# EAGLE design WiFly (EAGLE 9.6.2)
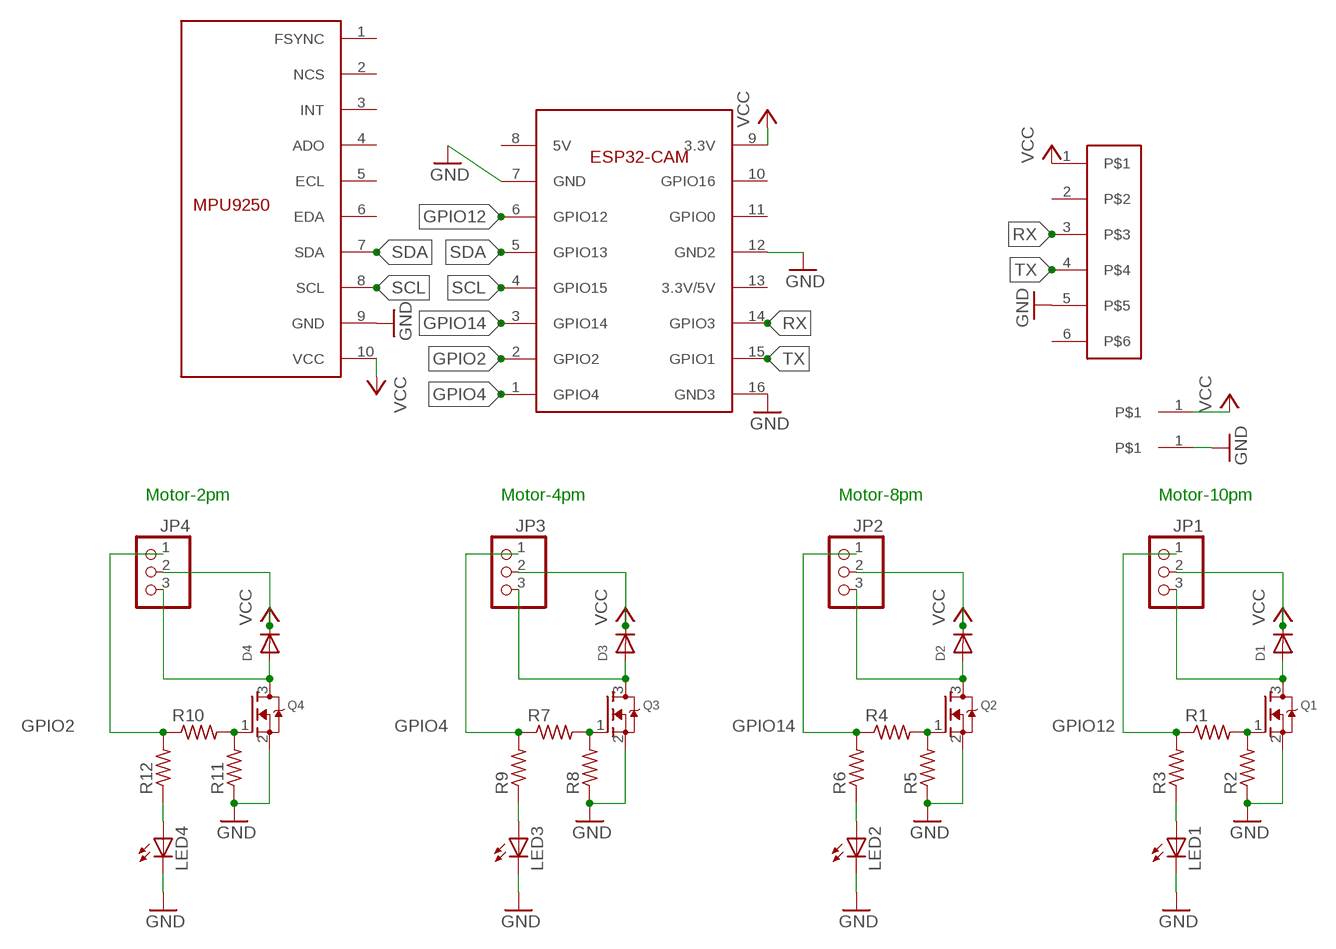
[diagram p0: schematic, sheet 1]

## Parts
+  22AWG22AWG-MALE  [HDRV1W64P0_1X1_193X193X447B]
-  22AWG22AWG-MALE  [HDRV1W64P0_1X1_193X193X447B]
D1  DIODESOD-323F  [SOD-323F]
D2  DIODESOD-323F  [SOD-323F]
D3  DIODESOD-323F  [SOD-323F]
D4  DIODESOD-323F  [SOD-323F]
JP1  PINHD-1X3CB  [1X03-CLEANBIG]
JP2  PINHD-1X3CB  [1X03-CLEANBIG]
JP3  PINHD-1X3CB  [1X03-CLEANBIG]
JP4  PINHD-1X3CB  [1X03-CLEANBIG]
LED1  LEDCHIP-LED0603  [CHIP-LED0603]
LED2  LEDCHIP-LED0603  [CHIP-LED0603]
LED3  LEDCHIP-LED0603  [CHIP-LED0603]
LED4  LEDCHIP-LED0603  [CHIP-LED0603]
Q1  MOSFET-NREFLOW  [SOT23]
Q2  MOSFET-NREFLOW  [SOT23]
Q3  MOSFET-NREFLOW  [SOT23]
Q4  MOSFET-NREFLOW  [SOT23]
R1  R-US_R0603  [R0603]
R2  R-US_R0603  [R0603]
R3  R-US_R0603  [R0603]
R4  R-US_R0603  [R0603]
R5  R-US_R0603  [R0603]
R6  R-US_R0603  [R0603]
R7  R-US_R0603  [R0603]
R8  R-US_R0603  [R0603]
R9  R-US_R0603  [R0603]
R10  R-US_R0603  [R0603]
R11  R-US_R0603  [R0603]
R12  R-US_R0603  [R0603]
U$1  MPU9250FEMALE_HEADER  [HDRVR10W64P254_1X10_2540X254X254B]
U$2  ESP32-CAMESP32-CAM  [HDRVR16W64P2286X254_2X8_2032X2540X254B]
U$3  6-PINFEMALE-6-PIN-A  [HDRVR6W64P254_1X6_1524X254X762B]

## Nets
GND: -.1 LED1.C LED2.C LED3.C LED4.C Q1.2(S) Q2.2(S) Q3.2(S) Q4.2(S) R2.1 R5.1 R8.1 R11.1 U$1.9(GND) U$2.7(GND) U$2.12(GND2) U$2.16(GND3) U$3.5
GPIO2: JP4.1 R10.1 R12.2 U$2.2(GPIO2)
GPIO4: JP3.1 R7.1 R9.2 U$2.1(GPIO4)
GPIO12: JP1.1 R1.1 R3.2 U$2.6(GPIO12)
GPIO14: JP2.1 R4.1 R6.2 U$2.3(GPIO14)
N$1 [VCC]: D1.A JP1.3 Q1.3(D)
N$2: Q1.1(G) R1.2 R2.2
N$4: LED1.A R3.1
N$6: Q2.1(G) R4.2 R5.2
N$7: LED2.A R6.1
N$8 [VCC]: D2.A JP2.3 Q2.3(D)
N$10: Q3.1(G) R7.2 R8.2
N$11: LED3.A R9.1
N$12 [VCC]: D3.A JP3.3 Q3.3(D)
N$14: Q4.1(G) R10.2 R11.2
N$15: LED4.A R12.1
N$16 [VCC]: D4.A JP4.3 Q4.3(D)
RX: U$2.14(GPIO3) U$3.3
SCL: U$1.8(SCL) U$2.4(GPIO15)
SDA: U$1.7(SDA) U$2.5(GPIO13)
TX: U$2.15(GPIO1) U$3.4
VCC [VCC]: +.1 D1.C D2.C D3.C D4.C JP1.2 JP2.2 JP3.2 JP4.2 U$1.10(VCC) U$2.9(3.3V) U$3.1
Unconnected: U$1.1(FSYNC) U$1.2(NCS) U$1.3(INT) U$1.4(ADO) U$1.5(ECL) U$1.6(EDA) U$2.8(5V) U$2.10(GPIO16) U$2.11(GPIO0) U$2.13(3.3V/5V) U$3.2 U$3.6

## Notes on the sheet
- Motor-2pm | Motor-4pm | Motor-8pm | Motor-10pm

## Library data of the parts
+ - = WiFlyParts:22AWG
D1-D4 = adafruit:DIODE: Diode SMADIODE - SMA Surface Mount Package 20V 1A Schottky Diode Digikey: 641-1014-6-ND DO-1N4148 - Through Hole Small Current Diode SOD-123 20V 1 A (.5mV Vf) Schottky Diode - Digikey: MBRX120TPMSCT-ND SOD-323 10V 570mA (.38mV Vf, 3ns) Schottky Diode - Digikey: ZLLS410CT-ND SOD-523 30V 30mA Schottky Diode (RB751S-40TE61) - Digikey: RB751S-40TE61CT-ND SOT23-R/W - SOT23 Package (R = Solder Paste/Reflow Ovens, W = Hand-Soldering) BAT54Film 40V 300mA - Digikey: 497-7162-1-ND
JP1-JP4 = adafruit:PINHD-1X3: PIN HEADER
LED1-LED4 = adafruit:LED: LED OSRAM: - CHIPLED LG R971, LG N971, LY N971, LG Q971, LY Q971, LO R971, LY R971 LH N974, LH R974 LS Q976, LO Q976, LY Q976 LO Q996 - Hyper CHIPLED LW Q18S LB Q993, LB Q99A, LB R99A - SideLED LS A670, LO A670, LY A670, LG A670, LP A670 LB A673, LV A673, LT A673, LW A673 LH A674 LY A675 LS A676, LA A676, LO A676, LY A676, LW A676 LS A679, LY A679, LG A679 - Hyper Micro SIDELED® LS Y876, LA Y876, LO Y876, LY Y876 LT Y87S - SmartLED LW L88C, LW L88S LB L89C, LB L89S, LG L890 LS L89K, LO L89K, LY L89K LS L896, LA L896, LO L896, LY L896 - TOPLED LS T670, LO T670, LY T670, LG T670, LP T670 LSG T670, LSP T670, LSY T670, LOP T670, LYG T670 LG T671, LOG T671, LSG T671 LB T673, LV T673, LT T673, LW T673 LH T674 LS T676, LA T676, LO T676, LY T676, LB T676, LH T676, LSB T676, LW T676 LB T67C, LV T67C, LT T67C, LS T67K, LO T67K, LY T67K, LW E67C LS E67B, LA E67B, LO E67B, LY E67B, LB E67C, LV E67C, LT E67C LW T67C LS T679, LY T679, LG T679 LS T770, LO T770, LY T770, LG T770, LP T770 LB T773, LV T773, LT T773, LW T773 LH T774 LS E675, LA E675, LY E675, LS T675 LS T776, LA T776, LO T776, LY T776, LB T776 LHGB T686 LT T68C, LB T68C - Hyper Mini TOPLED® LB M676 - Mini TOPLED Santana® LG M470 LS M47K, LO M47K, LY M47K Source: http://www.osram.convergy.de/
Q1-Q4 = adafruit:MOSFET-N: N-Channel Mosfet 2N7002E - 60V 260mA SOT23 [Digikey: 2N7002ET1GOSTR-ND] - REEL BSH103 - 30V 850mA SOT23 [Digikey: 568-5013-1-ND]
R1-R12 = adafruit:R-US_: RESISTOR, American symbol
U$1 = WiFlyParts:MPU9250
U$2 = WiFlyParts:ESP32-CAM
U$3 = WiFlyParts:6-PIN

## Net classes
0 default: width 0.406 mm
1 VCC: width 0.762 mm

## Board
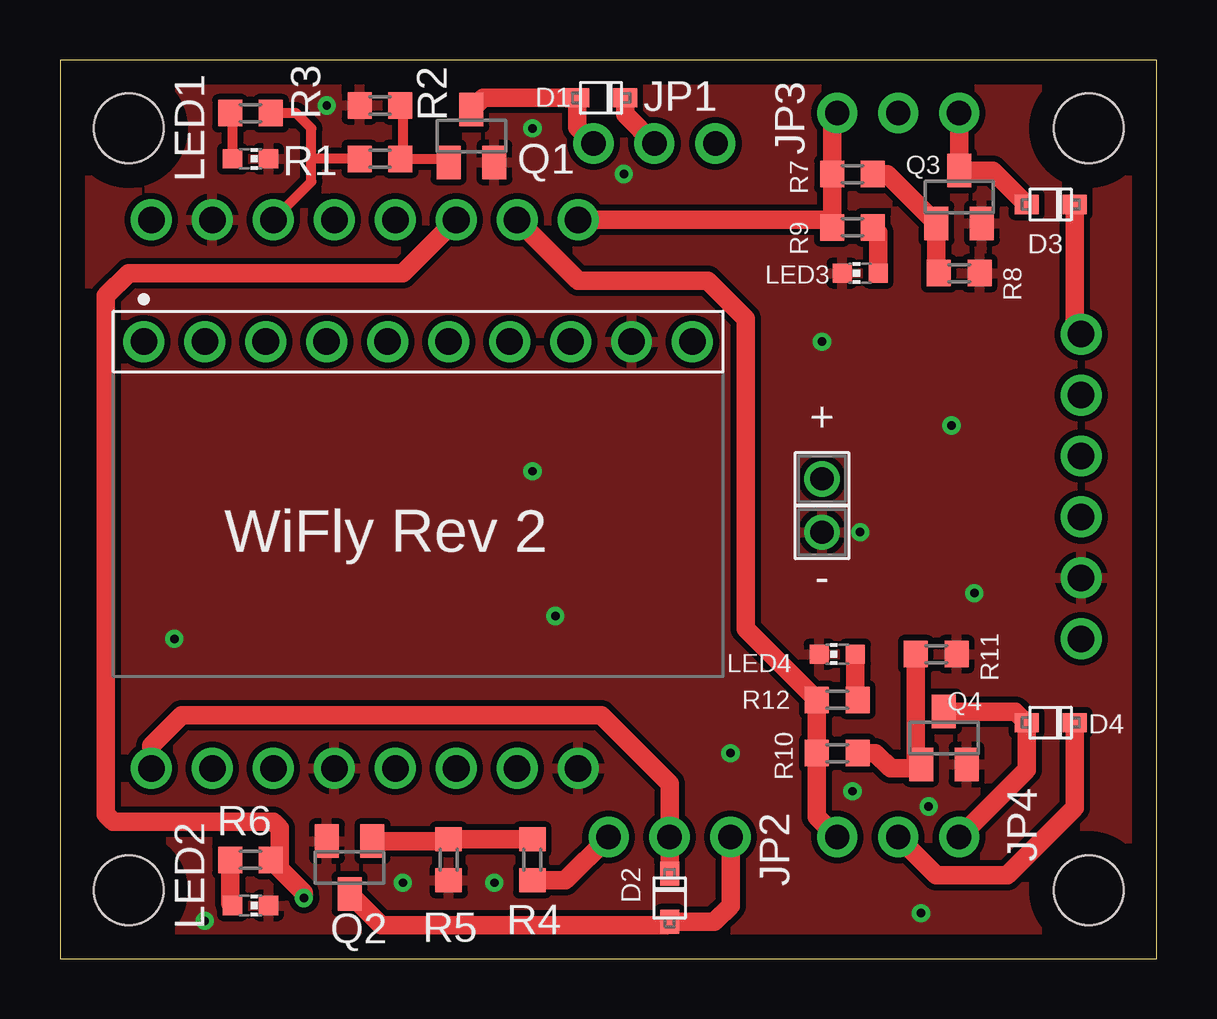
[diagram p1: board, top side]
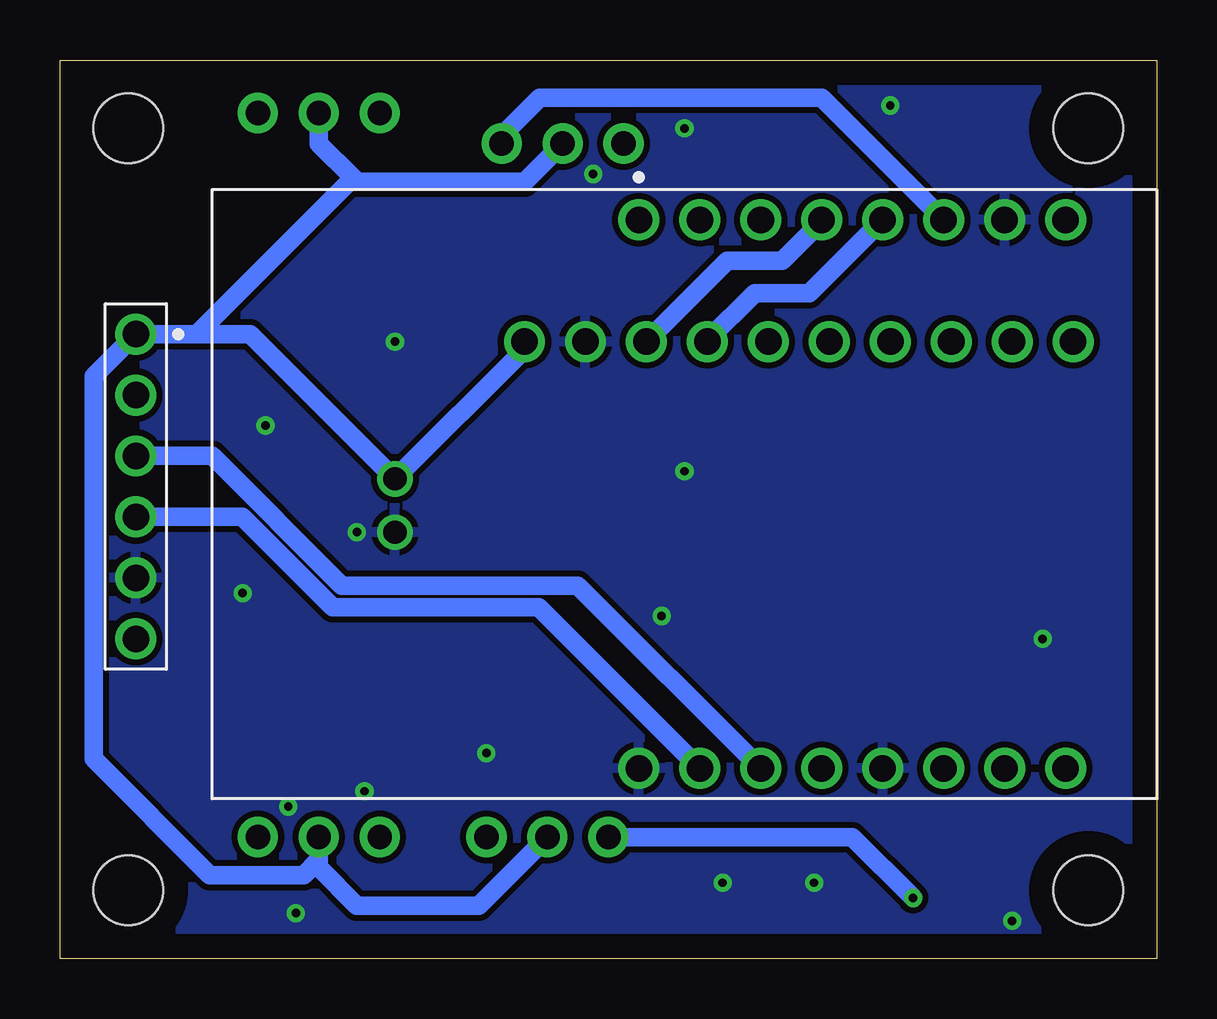
[diagram p2: board, bottom side, seen from below]

Size 45.71 x 37.45 mm. Coordinates in mm from the lower left corner, seen from the top.
Outline: 0,0 45.71,0 45.71,37.45 0,37.45 0,0
Copper layers (1*16): Top 0.035mm / dielectric 1.5mm / Bottom 0.035mm
Design rules "default": minimum track width 6mil, minimum drill 0.35mm, track to track 6mil, track to pad 6mil, pad to pad 6mil, via to via 6mil, smd to smd 6mil, copper to edge 40mil, drill to drill 6mil, minimum pad ring 10mil, minimum via ring 8mil, stop-mask expansion 4mil, vias tented up to drill 0mil, thermal gap 10mil
Holes 2.91 mm at 2.86,34.61 42.86,34.61 2.86,2.86 42.86,2.86

### Footprints (pad centres in the part's own frame; a part is rotated, then mirrored left to right if it is on the bottom)
HDRV1W64P0_1X1_193X193X447B = drill 0.965: 1 0,0
SOD-323F = smd 1 x 0.8: A -1,0; C 1,0
1X03-CLEANBIG = drill 1.016 pad 1.676: 1 -2.54,0; 2 0,0; 3 2.54,0
CHIP-LED0603 = smd 0.8 x 0.8: A 0,-0.75; C 0,0.75
SOT23 = smd 1 x 1.4: 1 -0.95,-1.1; 2 0.95,-1.1; 3 0,1.1
R0603 = smd 1 x 1.1: 1 -0.85,0; 2 0.85,0
HDRVR10W64P254_1X10_2540X254X254B = drill 1.105 pad 1.705: 1 1.27,-1.27; 2 3.81,-1.27; 3 6.35,-1.27; 4 8.89,-1.27; 5 11.43,-1.27; 6 13.97,-1.27; 7 16.51,-1.27; 8 19.05,-1.27; 9 21.59,-1.27; 10 24.13,-1.27
HDRVR16W64P2286X254_2X8_2032X2540X254B = drill 1.105 pad 1.705: 1 0,0; 2 2.54,0; 3 5.08,0; 4 7.62,0; 5 10.16,0; 6 12.7,0; 7 15.24,0; 8 17.78,0; 9 17.78,-22.86; 10 15.24,-22.86; 11 12.7,-22.86; 12 10.16,-22.86; 13 7.62,-22.86; 14 5.08,-22.86; 15 2.54,-22.86; 16 0,-22.86
HDRVR6W64P254_1X6_1524X254X762B = drill 1.105 pad 1.705: 1 0,0; 2 2.54,0; 3 5.08,0; 4 7.62,0; 5 10.16,0; 6 12.7,0

### Placement (x,y rotation side)
+  31.75,20 90 top
-  31.75,17.78 180 top
D1  22.54,35.88 0 top
D2  25.4,2.54 90 top
D3  41.27,31.43 0 top
D4  41.27,9.84 0 top
JP1  24.77,33.97 180 top
JP2  25.4,5.08 0 top
JP3  34.92,35.24 0 top
JP4  34.92,5.08 0 top
LED1  7.94,33.34 270 top
LED2  7.94,2.22 270 top
LED3  33.34,28.58 90 top
LED4  32.38,12.7 90 top
Q1  17.15,34.29 0 top
Q2  12.06,3.81 180 top
Q3  37.46,31.75 0 top
Q4  36.83,9.21 0 top
R1  13.33,33.34 0 top
R2  13.33,35.56 0 top
R3  7.94,35.24 0 top
R4  19.69,4.13 90 top
R5  16.19,4.13 90 top
R6  7.94,4.13 0 top
R7  33.02,32.7 0 top
R8  37.46,28.58 180 top
R9  33.02,30.48 180 top
R10  32.38,8.57 0 top
R11  36.51,12.7 180 top
R12  32.38,10.79 180 top
U$1  2.22,26.99 0 top
U$2  21.59,30.8 0 bottom
U$3  42.54,26.03 270 bottom

### Tracks (layer width: path | path; a pad name or v marks a point on that pad's centre or on a via)
GND  (via drill 0.35)
  other vias: 33.02,6.99 36.2,6.35 6.03,1.59 11.11,35.56 14.29,3.17 18.1,3.17 19.69,34.61 35.88,1.9 37.15,22.23 19.69,20.32 38.1,15.24 4.76,13.33 27.94,8.57 31.75,25.72 23.5,32.7 20.64,14.29 33.34,17.78
  pour Bottom (isolate 0.254): 0,0 0,37.47 45.72,37.47 45.72,0
  pour Top (isolate 0.254): 0,0 0,37.47 45.72,37.47 45.72,0
GPIO2
  Top 0.762: JP4.1 31.54,5.93 R10.1 R12.2 28.58,13.76 28.58,26.67 26.99,28.26 21.59,28.26 U$2.2
GPIO4
  Top 0.762: JP3.1 32.17,35.03 R7.1 R9.2 31.85,30.8 U$2.1
GPIO12
  Top 0.406: U$2.6 10.48,32.38 10.48,33.34 | 10.48,33.34 10.48,34.61 9.84,35.24 R3.2 | R1.1 10.48,33.34
  Bottom 0.762: U$2.6 13.97,35.88 25.72,35.88 27.31,34.29 JP1.1
GPIO14  (via drill 0.35)
  Top 0.762: R4.1 21.06,3.28 JP2.1 | R6.2 9.16,3.76 | 9.16,3.76 10.16,2.76 v10.16,2.54 | U$2.3 14.29,28.58 2.86,28.58 1.91,27.62 1.91,6.03 2.22,5.71 8.89,5.71 9.16,5.45 9.16,3.76
  Bottom 0.762: v10.16,2.54 12.7,5.08 JP2.1
N$1
  Top 0.762: Q1.3 17.63,35.88 D1.A 21.54,34.65 JP1.3
N$2
  Top 0.406: R1.2 14.29,33.34 | 14.29,33.34 16.05,33.34 Q1.1 | R2.2 14.29,35.46 14.29,33.34
N$4
  Top 0.406: LED1.A 7.19,35.14 R3.1
N$6
  Top 0.762: Q2.1 16.12,4.91 R5.2 R4.2
N$7
  Top 0.762: LED2.A 7.09,2.32 R6.1
N$8
  Top 0.762: Q2.3 13.38,1.4 25.26,1.4 D2.A 27.26,1.54 27.94,2.22 JP2.3
N$10
  Top 0.762: R7.2 34.46,32.7 Q3.1 36.52,28.67 R8.2
N$11
  Top 0.762: LED3.A 34.09,30.26 R9.1
N$12
  Top 0.762: JP3.3 Q3.3 38.86,32.85 D3.A
N$14
  Top 0.762: R10.2 33.97,8.57 34.61,7.94 35.71,7.94 Q4.1 35.66,8.33 R11.2
N$15
  Top 0.762: LED4.A 33.13,10.89 R12.1
N$16
  Top 0.762: Q4.3 39.81,10.31 D4.A 40.27,7.89 JP4.3
RX
  Bottom 0.762: U$2.14 24.13,15.56 33.97,15.56 39.37,20.96 U$3.3
SCL
  Bottom 0.762: U$1.8 17.9,29.09 15.62,29.09 13.97,30.74 U$2.4
SDA
  Bottom 0.762: U$2.5 14.49,27.74 16.77,27.74 18.73,25.77 U$1.7
TX
  Bottom 0.762: U$2.15 25.76,14.64 34.35,14.64 38.12,18.41 U$3.4
VCC
  Top 0.762: D1.C 23.54,35.19 JP1.2 | D2.C JP2.2 25.4,7.3 22.54,10.16 5.08,10.16 3.81,8.89 U$2.9 | JP4.2 36.51,3.49 39.47,3.49 42.27,6.3 D4.C | D3.C 42.27,26.31 U$3.1
  Bottom 0.762: JP2.2 28.26,2.22 33.34,2.22 34.92,3.81 JP4.2 34.92,4.13 35.56,3.49 39.47,3.49 44.31,8.34 44.31,24.27 U$3.1 | JP1.2 26.35,32.38 33.34,32.38 33.5,32.54 | 33.5,32.54 34.92,33.97 JP3.2 | U$3.1 40,26.03 33.5,32.54 | U$3.1 37.78,26.03 +.1 26.35,25.4 U$1.10

### Text on the board
tNames: WiFly Rev 2